# Altium schematic sheet Gate_Driver.SchDoc
size Letter; SheetNumber: 2; SheetTotal: 5
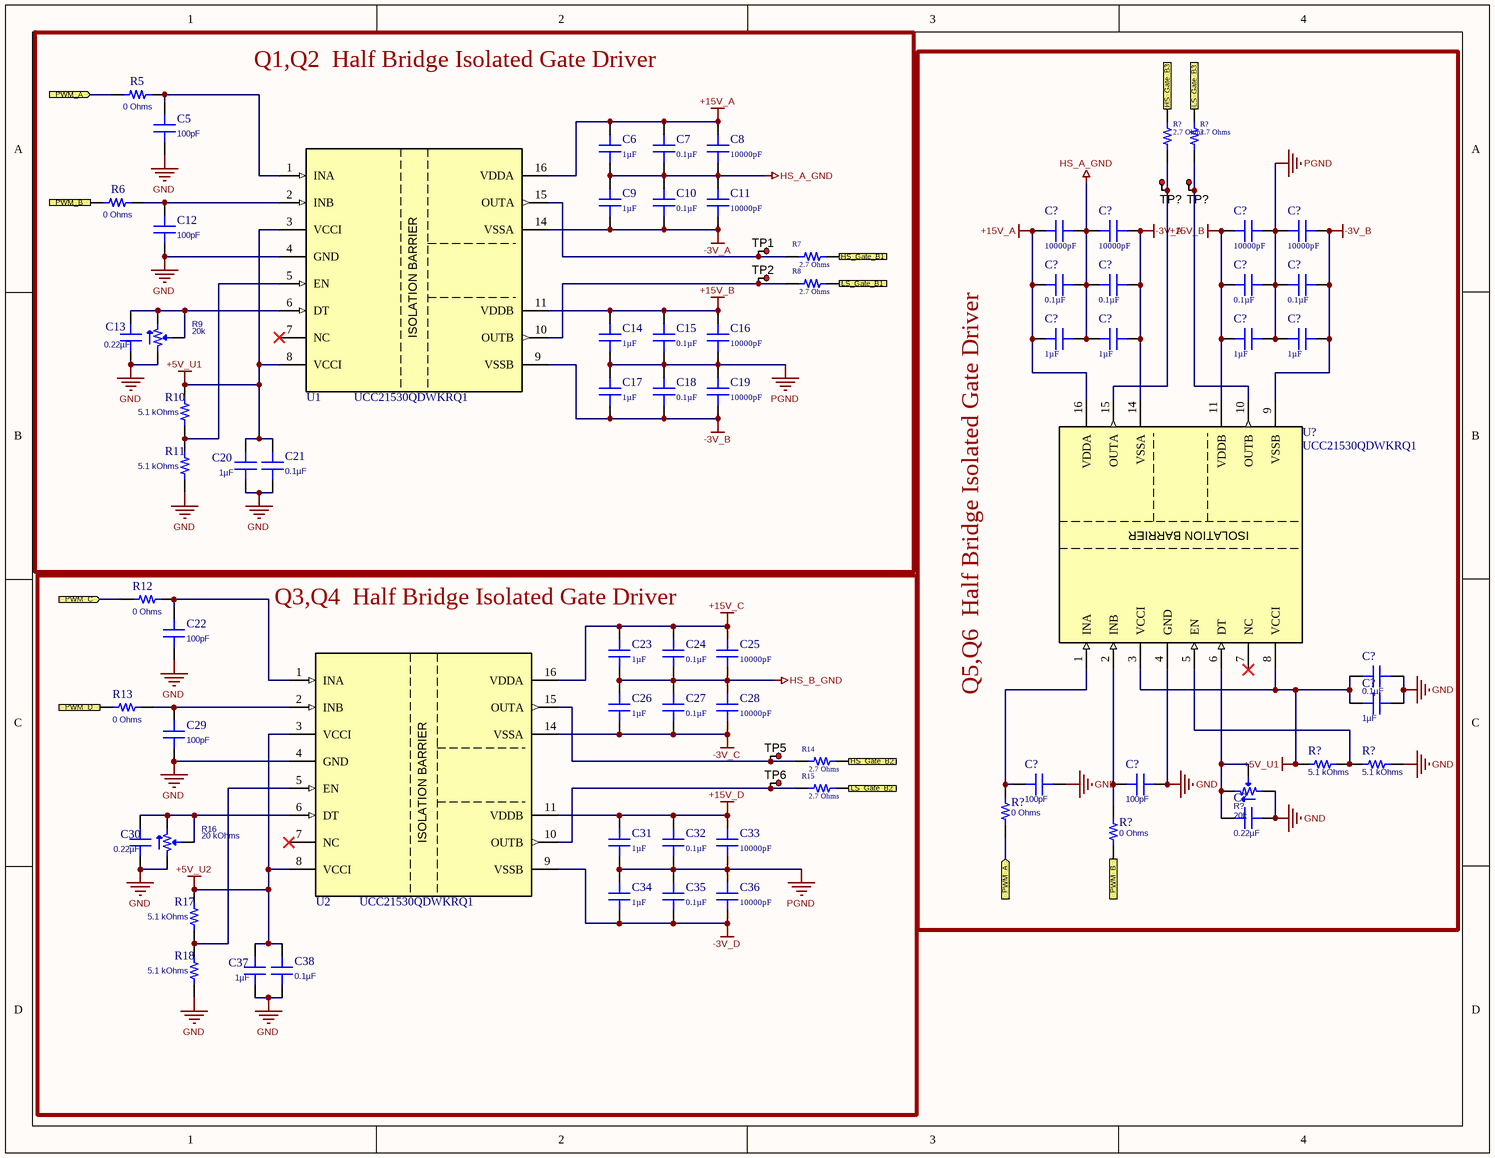
[diagram p0: Gate_Driver.SchDoc]

## Parts
(Parts that share a designator on the sheet are numbered #1, #2 ... from top to bottom, then left to right.)
C5  100pF  [CAP 0603_1608]
C6  1µF  [CAP 0603_1608]
C7  0.1µF  [CAP 0603_1608]
C8  10000pF  [CAP 0603_1608]
C9  1µF  [CAP 0603_1608]
C10  0.1µF  [CAP 0603_1608]
C11  10000pF  [CAP 0603_1608]
C12  100pF  [CAP 0603_1608]
C13  0.22µF  [CAP 0603_1608]
C14  1µF  [CAP 0603_1608]
C15  0.1µF  [CAP 0603_1608]
C16  10000pF  [CAP 0603_1608]
C17  1µF  [CAP 0603_1608]
C18  0.1µF  [CAP 0603_1608]
C19  10000pF  [CAP 0603_1608]
C20  1µF  [CAP 0603_1608]
C21  0.1µF  [CAP 0603_1608]
C22  100pF  [CAP 0603_1608]
C23  1µF  [CAP 0603_1608]
C24  0.1µF  [CAP 0603_1608]
C25  10000pF  [CAP 0603_1608]
C26  1µF  [CAP 0603_1608]
C27  0.1µF  [CAP 0603_1608]
C28  10000pF  [CAP 0603_1608]
C29  100pF  [CAP 0603_1608]
C30  0.22µF  [CAP 0603_1608]
C31  1µF  [CAP 0603_1608]
C32  0.1µF  [CAP 0603_1608]
C33  10000pF  [CAP 0603_1608]
C34  1µF  [CAP 0603_1608]
C35  0.1µF  [CAP 0603_1608]
C36  10000pF  [CAP 0603_1608]
C37  1µF  [CAP 0603_1608]
C38  0.1µF  [CAP 0603_1608]
C?#1  10000pF  [CAP 0603_1608]
C?#2  10000pF  [CAP 0603_1608]
C?#3  10000pF  [CAP 0603_1608]
C?#4  10000pF  [CAP 0603_1608]
C?#5  0.1µF  [CAP 0603_1608]
C?#6  0.1µF  [CAP 0603_1608]
C?#7  0.1µF  [CAP 0603_1608]
C?#8  0.1µF  [CAP 0603_1608]
C?#9  1µF  [CAP 0603_1608]
C?#10  1µF  [CAP 0603_1608]
C?#11  1µF  [CAP 0603_1608]
C?#12  1µF  [CAP 0603_1608]
C?#13  0.1µF  [CAP 0603_1608]
C?#14  1µF  [CAP 0603_1608]
C?#15  100pF  [CAP 0603_1608]
C?#16  100pF  [CAP 0603_1608]
C?#17  0.22µF  [CAP 0603_1608]
R5  0 Ohms  [RES 0603_1608]
R6  0 Ohms  [RES 0603_1608]
R7  2.7 Ohms  [RES 1206_3216]
R8  2.7 Ohms  [RES 1206_3216]
R9  20k  [POT BOURNS TRIMPOT TC33]
R10  5.1 kOhms  [RES 0603_1608]
R11  5.1 kOhms  [RES 0603_1608]
R12  0 Ohms  [RES 0603_1608]
R13  0 Ohms  [RES 0603_1608]
R14  2.7 Ohms  [RES 1206_3216]
R15  2.7 Ohms  [RES 1206_3216]
R16  20 kOhms  [POT BOURNS TRIMPOT TC33]
R17  5.1 kOhms  [RES 0603_1608]
R18  5.1 kOhms  [RES 0603_1608]
R?#1  2.7 Ohms  [RES 1206_3216]
R?#2  2.7 Ohms  [RES 1206_3216]
R?#3  5.1 kOhms  [RES 0603_1608]
R?#4  5.1 kOhms  [RES 0603_1608]
R?#5  20k  [POT BOURNS TRIMPOT TC33]
R?#6  0 Ohms  [RES 0603_1608]
R?#7  0 Ohms  [RES 0603_1608]
TP1  5010  [Keystone5010]  (value not drawn)
TP2  5010  [Keystone5010]  (value not drawn)
TP5  5010  [Keystone5010]  (value not drawn)
TP6  5010  [Keystone5010]  (value not drawn)
TP?#1  5010  [Keystone5010]  (value not drawn)
TP?#2  5010  [Keystone5010]  (value not drawn)
U1  UCC21530QDWKRQ1  [DW0016B_HV]
U2  UCC21530QDWKRQ1  [DW0016B_HV]
U?  UCC21530QDWKRQ1  [DW0016B_HV]

## Blocks framed on the sheet
Q1,Q2  Half Bridge Isolated Gate Driver: C5-C21 R5-R11 TP1 TP2 U1
Q5,Q6  Half Bridge Isolated Gate Driver: C?#1-C?#17 R?#1-R?#7 TP?#1 TP?#2 U?
Q3,Q4  Half Bridge Isolated Gate Driver: C22-C38 R12-R18 TP5 TP6 U2

## Ports
HS_Gate_B1 (out), HS_Gate_B2 (out), HS_Gate_B3 (out), LS_Gate_B1 (out), LS_Gate_B2 (out), LS_Gate_B3 (out), PWM_A (in), PWM_B (in), PWM_C (in), PWM_D (in)

## Nets
+5V_U1: C20.2 C21.2 C?#13.2 C?#14.2 R10.2 R?#3.2 U1.3(VCCI) U1.8(VCCI) U?.3(VCCI) U?.8(VCCI)
+5V_U2: C37.2 C38.2 R17.2 U2.3(VCCI) U2.8(VCCI)
+15V_A: C6.2 C7.2 C8.2 C?#1.2 C?#5.2 C?#9.2 U1.16(VDDA) U?.16(VDDA)
+15V_B: C14.2 C15.2 C16.2 C?#3.2 C?#7.2 C?#11.2 U1.11(VDDB) U?.11(VDDB)
+15V_C: C23.2 C24.2 C25.2 U2.16(VDDA)
+15V_D: C31.2 C32.2 C33.2 U2.11(VDDB)
-3V_A: C9.1 C10.1 C11.1 C?#2.1 C?#6.1 C?#10.1 U1.14(VSSA) U?.14(VSSA)
-3V_B: C17.1 C18.1 C19.1 C?#4.1 C?#8.1 C?#12.1 U1.9(VSSB) U?.9(VSSB)
-3V_C: C26.1 C27.1 C28.1 U2.14(VSSA)
-3V_D: C34.1 C35.1 C36.1 U2.9(VSSB)
GND: C5.1 C12.1 C13.1 C20.1 C21.1 C22.1 C29.1 C30.1 C37.1 C38.1 C?#13.1 C?#14.1 C?#15.1 C?#16.1 C?#17.1 R9.1 R11.1 R16.1 R18.1 R?#4.1 R?#5.1 U1.4(GND) U2.4(GND) U?.4(GND)
HS_A_GND: C6.1 C7.1 C8.1 C9.2 C10.2 C11.2 C?#1.1 C?#2.2 C?#5.1 C?#6.2 C?#9.1 C?#10.2
HS_B_GND: C23.1 C24.1 C25.1 C26.2 C27.2 C28.2
PGND: C14.1 C15.1 C16.1 C17.2 C18.2 C19.2 C31.1 C32.1 C33.1 C34.2 C35.2 C36.2 C?#3.1 C?#4.2 C?#7.1 C?#8.2 C?#11.1 C?#12.2
HS_Gate_B1: R7.2 ; port HS_Gate_B1
HS_Gate_B2: R14.2 ; port HS_Gate_B2
HS_Gate_B3: R?#1.2 ; port HS_Gate_B3
LS_Gate_B1: R8.2 ; port LS_Gate_B1
LS_Gate_B2: R15.2 ; port LS_Gate_B2
LS_Gate_B3: R?#2.2 ; port LS_Gate_B3
PWM_A: R5.1 R?#6.1 ; port PWM_A
PWM_B: R6.1 R?#7.1 ; port PWM_B
PWM_C: R12.1 ; port PWM_C
PWM_D: R13.1 ; port PWM_D
NetC5_2: C5.2 R5.2 U1.1(INA)
NetC12_2: C12.2 R6.2 U1.2(INB)
NetC13_2: C13.2 R9.2 R9.3 U1.6(DT)
NetC22_2: C22.2 R12.2 U2.1(INA)
NetC29_2: C29.2 R13.2 U2.2(INB)
NetC30_2: C30.2 R16.2 R16.3 U2.6(DT)
NetC?#15_2: C?#15.2 R?#6.2 U?.1(INA)
NetC?#16_2: C?#16.2 R?#7.2 U?.2(INB)
NetC?#17_2: C?#17.2 R?#5.2 R?#5.3 U?.6(DT)
NetR7_1: R7.1 TP1.1 U1.15(OUTA)
NetR8_1: R8.1 TP2.1 U1.10(OUTB)
NetR10_1: R10.1 R11.2 U1.5(EN)
NetR14_1: R14.1 TP5.1 U2.15(OUTA)
NetR15_1: R15.1 TP6.1 U2.10(OUTB)
NetR17_1: R17.1 R18.2 U2.5(EN)
NetR?#1_1: R?#1.1 TP?#1.1 U?.15(OUTA)
NetR?#2_1: R?#2.1 TP?#2.1 U?.10(OUTB)
NetR?#3_1: R?#3.1 R?#4.2 U?.5(EN)

Not connected (* = marked no-connect by the designer): U1 7(NC)*; U2 7(NC)*; U? 7(NC)*

## Notes on the sheet
- (in symbol UCC21530QDWKRQ1 (2)) ISOLATION BARRIER

## Library data of the parts
C5 C12 C22 C29 C?#15 C?#16 = GCM1885C2A101JA16D: CAP CER 100PF 100V C0G/NP0 0603; Manufacturer: Murata Electronics; Temperature Coefficient: C0G, NP0; Tolerance: ±5%; Part Number: GCM1885C2A101JA16D; Value: 100pF; Applications: Automotive; Capacitance: 100pF; ComponentLink1Description: Datasheet; ComponentLink1URL: https://psearch.en.murata.com/capacitor/product/GCM1885C2A101JA16%23.pdf; ComponentLink2Description: DigiKey Link; ComponentLink2URL: http://digikey.com/product-detail/en/murata-electronics/GCM1885C2A101JA16D/490-4771-1-ND/1641690; Device Package: 0603 (1608 Metric); LastUpdated: 2/9/2020 01:03:33; Lifecycle Status: Active; Minimum Order: 1; Mounting Type: Surface Mount, MLCC; Operating Temperature: -55°C ~ 125°C; Package / Case: 0603 (1608 Metric); Packaging: TapeAndReel; PartId: 3835; Part Status: Active; Price: 0.02; Ratings: AEC-Q200; Series: GCM; Size / Dimension: 0.063" L x 0.031" W (1.60mm x 0.80mm); Supplier 1: DigiKey; Supplier Part Number 1: 490-4771-1-ND; Thickness (Max): 0.035" (0.90mm); Voltage - Rated: 100V
C6 C9 C14 C17 C20 C23 C26 C31 C34 C37 C?#9-C?#12 C?#14 = UMK107AB7105KA-T: CAP CER 1UF 50V X7R 0603; Manufacturer: Taiyo Yuden; Tolerance: ±10%; Part Number: UMK107AB7105KA-T; Value: 1µF; Applications: General Purpose; Capacitance: 1µF; ComponentLink1Description: Datasheet; ComponentLink1URL: https://www.yuden.co.jp/productdata/catalog/mlcc01_e.pdf; ComponentLink2Description: DigiKey Link; ComponentLink2URL: http://digikey.com/product-detail/en/taiyo-yuden/UMK107AB7105KA-T/587-3247-1-ND/3660107; Device Package: 0603 (1608 Metric); LastUpdated: 2/9/2020 01:03:17; Lifecycle Status: Active; Minimum Order: 1; Mounting Type: Surface Mount, MLCC; Operating Temperature: -55°C ~ 125°C; Package / Case: 0603 (1608 Metric); Packaging: TapeAndReel; PartId: 12796; Part Status: Active; Price: 0.05; Series: M; Size / Dimension: 0.063" L x 0.031" W (1.60mm x 0.80mm); Supplier 1: DigiKey; Supplier Part Number 1: 587-3247-1-ND; Temperature Coefficient: X7R; Thickness (Max): 0.037" (0.95mm); Voltage - Rated: 50V
C7 C10 C15 C18 C24 C27 C32 C35 C?#5-C?#8 = C0603C104M5RACTU: CAP CER 0.1UF 50V X7R 0603; Manufacturer: KEMET; Tolerance: ±20%; Part Number: C0603C104M5RACTU; Value: 0.1µF; Applications: Bypass, Decoupling; Capacitance: 0.1µF; ComponentLink1Description: Datasheet; ComponentLink1URL: https://api.kemet.com/component-edge/download/datasheet/C0603C104M5RACTU.pdf; ComponentLink2Description: DigiKey Link; ComponentLink2URL: http://digikey.com/product-detail/en/kemet/C0603C104M5RACTU/399-7845-1-ND/3471568; Device Package: 0603 (1608 Metric); LastUpdated: 2/9/2020 01:03:01; Lifecycle Status: Active; Minimum Order: 1; Mounting Type: Surface Mount, MLCC; Operating Temperature: -55°C ~ 125°C; Package / Case: 0603 (1608 Metric); Packaging: TapeAndReel; PartId: 17854; Part Status: Active; Price: 0.01; Series: SMD Comm X7R; Size / Dimension: 0.063" L x 0.031" W (1.60mm x 0.80mm); Supplier 1: DigiKey; Supplier Part Number 1: 399-7845-1-ND; Temperature Coefficient: X7R; Thickness (Max): 0.034" (0.87mm); Voltage - Rated: 50V
C8 C11 C16 C19 C25 C28 C33 C36 C?#1-C?#4 = CGA3E2C0G1H103J080AA: CAP CER 10000PF 50V C0G 0603; Manufacturer: TDK Corporation; Temperature Coefficient: C0G, NP0; Tolerance: ±5%; Part Number: CGA3E2C0G1H103J080AA; Value: 10000pF; Applications: Automotive; Capacitance: 10000pF; ComponentLink1Description: Datasheet; ComponentLink1URL: https://product.tdk.com/info/en/catalog/datasheets/mlcc_automotive_general_en.pdf?ref_disty=digikey; ComponentLink2Description: DigiKey Link; ComponentLink2URL: http://digikey.com/product-detail/en/tdk-corporation/CGA3E2C0G1H103J080AA/445-6916-1-ND/2672934; Device Package: 0603 (1608 Metric); LastUpdated: 2/9/2020 01:03:33; Lifecycle Status: Active; Minimum Order: 1; Mounting Type: Surface Mount, MLCC; Operating Temperature: -55°C ~ 125°C; Package / Case: 0603 (1608 Metric); Packaging: TapeAndReel; PartId: 4079; Part Status: Active; Price: 0.06; Ratings: AEC-Q200; Series: CGA; Size / Dimension: 0.063" L x 0.031" W (1.60mm x 0.80mm); Supplier 1: DigiKey; Supplier Part Number 1: 445-6916-1-ND; Thickness (Max): 0.035" (0.90mm); Voltage - Rated: 50V
C13 C30 C?#17 = GRM188R71E224KA88J: CAP CER 0.22UF 25V X7R 0603; Manufacturer: Murata Electronics; Tolerance: ±10%; Part Number: GRM188R71E224KA88J; Value: 0.22µF; Applications: General Purpose; Capacitance: 0.22µF; ComponentLink1Description: Datasheet; ComponentLink1URL: https://www.murata.com/~/media/webrenewal/support/library/catalog/products/capacitor/mlcc/c02e.ashx?la=en-us; ComponentLink2Description: DigiKey Link; ComponentLink2URL: http://digikey.com/product-detail/en/murata-electronics/GRM188R71E224KA88J/490-11522-1-ND/5333362; Device Package: 0603 (1608 Metric); LastUpdated: 2/9/2020 01:03:21; Lifecycle Status: Active; Minimum Order: 1; Mounting Type: Surface Mount, MLCC; Operating Temperature: -55°C ~ 125°C; Package / Case: 0603 (1608 Metric); Packaging: TapeAndReel; PartId: 10549; Part Status: Active; Price: 0.03; Series: GRM; Size / Dimension: 0.063" L x 0.031" W (1.60mm x 0.80mm); Supplier 1: DigiKey; Supplier Part Number 1: 490-11522-1-ND; Temperature Coefficient: X7R; Thickness (Max): 0.035" (0.90mm); Voltage - Rated: 25V
C21 C38 C?#13 = CGA3E2X7R1E104K080AA: CAP CER 0.1UF 25V X7R 0603; Manufacturer: TDK Corporation; Tolerance: ±10%; Part Number: CGA3E2X7R1E104K080AA; Value: 0.1µF; Applications: Automotive; Capacitance: 0.1µF; ComponentLink1Description: Datasheet; ComponentLink1URL: https://product.tdk.com/info/en/catalog/datasheets/mlcc_automotive_general_en.pdf?ref_disty=digikey; ComponentLink2Description: DigiKey Link; ComponentLink2URL: http://digikey.com/product-detail/en/tdk-corporation/CGA3E2X7R1E104K080AA/445-5667-1-ND/2443707; Device Package: 0603 (1608 Metric); LastUpdated: 2/9/2020 01:03:30; Lifecycle Status: Active; Minimum Order: 1; Mounting Type: Surface Mount, MLCC; Operating Temperature: -55°C ~ 125°C; Package / Case: 0603 (1608 Metric); Packaging: TapeAndReel; PartId: 5534; Part Status: Active; Price: 0.01; Ratings: AEC-Q200; Series: CGA; Size / Dimension: 0.063" L x 0.031" W (1.60mm x 0.80mm); Supplier 1: DigiKey; Supplier Part Number 1: 445-5667-1-ND; Temperature Coefficient: X7R; Thickness (Max): 0.035" (0.90mm); Voltage - Rated: 25V
R5 R6 R12 R13 R?#6 R?#7 = CRCW06030000Z0EAHP: RES SMD 0 OHM JUMPER 1/4W 0603; Manufacturer: Vishay Dale; Power (Watts): 0.25W, 1/4W; Part Number: CRCW06030000Z0EAHP; Value: 0 Ohms; ComponentLink1Description: Datasheet; ComponentLink1URL: http://www.vishay.com/docs/20043/crcwhpe3.pdf; ComponentLink2Description: DigiKey Link; ComponentLink2URL: http://digikey.com/product-detail/en/vishay-dale/CRCW06030000Z0EAHP/541-0.0SBCT-ND/2222749; Composition: Thick Film; Device Package: 0603 (1608 Metric); Features: Automotive AEC-Q200, Pulse Withstanding; Height - Seated (Max): 0.022" (0.55mm); LastUpdated: 2/9/2020 01:10:23; Lifecycle Status: Active; Minimum Order: 1; Number of Terminations: 2; Operating Temperature: -55°C ~ 155°C; Package / Case: 0603 (1608 Metric); Packaging: TapeAndReel; PartId: 5474; Part Status: Active; Price: 0.02; Ratings: AEC-Q200; Resistance: 0 Ohms; Series: CRCW-HP; Size / Dimension: 0.063" L x 0.033" W (1.60mm x 0.85mm); Supplier 1: DigiKey; Supplier Part Number 1: 541-0.0SBCT-ND; Supplier Device Package: 0603; Tolerance: Jumper
R7 R8 R14 R15 R?#1 R?#2 = CRCW12062R70FKEAHP: RES SMD 2.7 OHM 1% 3/4W 1206; Manufacturer: Vishay Dale; Power (Watts): 0.75W, 3/4W; Temperature Coefficient: ±100ppm/°C; Part Number: CRCW12062R70FKEAHP; ComponentLink1Description: Datasheet; ComponentLink1URL: http://www.vishay.com/docs/20043/crcwhpe3.pdf; ComponentLink2Description: DigiKey Link; ComponentLink2URL: http://digikey.com/product-detail/en/vishay-dale/CRCW12062R70FKEAHP/541-2.70UCT-ND/5326978; Composition: Thick Film; Device Package: 1206 (3216 Metric); Features: Automotive AEC-Q200, Pulse Withstanding; Height - Seated (Max): 0.024" (0.60mm); LastUpdated: 2/9/2020 01:12:48; Lifecycle Status: Active; Minimum Order: 1; Number of Terminations: 2; Operating Temperature: -55°C ~ 155°C; Package / Case: 1206 (3216 Metric); Packaging: TapeAndReel; PartId: 36112; Part Status: Active; Price: 0.06; Ratings: AEC-Q200; Resistance: 2.7 Ohms; Series: CRCW-HP; Size / Dimension: 0.122" L x 0.063" W (3.10mm x 1.60mm); Supplier 1: DigiKey; Supplier Part Number 1: 541-2.70UCT-ND; Supplier Device Package: 1206; Tolerance: ±1%; Value: 2.7 Ohms
R9 R?#5 = TC33X-2-203E: TRIMMER 20K OHM 0.1W J LEAD TOP; Manufacturer: Bourns Inc.; Adjustment Type: Top Adjustment; Number of Turns: 1; Power (Watts): 0.1W, 1/10W; Resistance: 20 kOhms; Resistive Material: Cermet; Temperature Coefficient: ±250ppm/°C; Tolerance: ±25%; Part Number: TC33X-2-203E; ComponentLink1Description: Datasheet; ComponentLink1URL: https://www.bourns.com/docs/Product-Datasheets/TC33.pdf; ComponentLink2Description: DigiKey Link; ComponentLink2URL: http://digikey.com/product-detail/en/bourns-inc/TC33X-2-203E/TC33X-2-203ECT-ND/3437930; LastUpdated: 2/9/2020 01:21:42; Lifecycle Status: Active; Minimum Order: 1; Mounting Type: Surface Mount; Packaging: TapeAndReel; PartId: 12; Part Status: Active; Price: 0.15; Series: Trimpot® TC33 - Open Frame; Size / Dimension: Rectangular - 0.150" x 0.142" Face x 0.047" H (3.80mm x 3.60mm x 1.20mm); Supplier 1: DigiKey; Supplier Part Number 1: TC33X-2-203ECT-ND; Termination Style: J Lead; Value: 20k
R10 R11 R17 R18 R?#3 R?#4 = RC0603JR-075K1L: RES SMD 5.1K OHM 5% 1/10W 0603; Manufacturer: Yageo; Power (Watts): 0.1W, 1/10W; Temperature Coefficient: ±100ppm/°C; Part Number: RC0603JR-075K1L; Value: 5.1 kOhms; ComponentLink1Description: Datasheet; ComponentLink1URL: https://www.yageo.com/upload/media/product/productsearch/datasheet/rchip/PYu-RC_Group_51_RoHS_L_10.pdf; ComponentLink2Description: DigiKey Link; ComponentLink2URL: http://digikey.com/product-detail/en/yageo/RC0603JR-075K1L/311-5.1KGRCT-ND/729743; Composition: Thick Film; Device Package: 0603 (1608 Metric); Features: Moisture Resistant; Height - Seated (Max): 0.022" (0.55mm); LastUpdated: 2/9/2020 01:09:58; Lifecycle Status: Active; Minimum Order: 1; Number of Terminations: 2; Operating Temperature: -55°C ~ 155°C; Package / Case: 0603 (1608 Metric); Packaging: CutTape; PartId: 17113; Part Status: Active; Price: 0.10; Resistance: 5.1 kOhms; Series: RC; Size / Dimension: 0.063" L x 0.031" W (1.60mm x 0.80mm); Supplier 1: DigiKey; Supplier Part Number 1: 311-5.1KGRCT-ND; Supplier Device Package: 0603; Tolerance: ±5%
R16 = TC33X-2-203E: TRIMMER 20K OHM 0.1W J LEAD TOP; Manufacturer: Bourns Inc.; Adjustment Type: Top Adjustment; Number of Turns: 1; Power (Watts): 0.1W, 1/10W; Resistive Material: Cermet; Temperature Coefficient: ±250ppm/°C; Tolerance: ±25%; Part Number: TC33X-2-203E; ComponentLink1Description: Datasheet; ComponentLink1URL: https://www.bourns.com/docs/Product-Datasheets/TC33.pdf; ComponentLink2Description: DigiKey Link; ComponentLink2URL: http://digikey.com/product-detail/en/bourns-inc/TC33X-2-203E/TC33X-2-203ECT-ND/3437930; LastUpdated: 2/9/2020 01:21:42; Lifecycle Status: Active; Minimum Order: 1; Mounting Type: Surface Mount; Packaging: TapeAndReel; PartId: 12; Part Status: Active; Price: 0.15; Resistance: 20 kOhms; Series: Trimpot® TC33 - Open Frame; Size / Dimension: Rectangular - 0.150" x 0.142" Face x 0.047" H (3.80mm x 3.60mm x 1.20mm); Supplier 1: DigiKey; Supplier Part Number 1: TC33X-2-203ECT-ND; Termination Style: J Lead; Value: 20 kOhms
TP1 TP2 TP5 TP6 TP?#1 TP?#2 = 5010: Test Point, Multipurpose, Red, TH; Manufacturer: Keystone; CompType: Test Point Loop; ContactFinish: Silver; SymbolVersion: 2008-04-04; PartNumber: 5010; PackageReference: Red Multipurpose Testpoint; RoHS: Y; MountType: TH; ComponentLink1Description: Datasheet URL; ComponentLink1URL: http://www.keyelco.com/userAssets/file/M60-2p60.pdf; Color: Red; Publisher: Texas Instruments; LatestRevisionDate: 2016-02-11; Supplier 1: Digi-Key; Supplier Part Number 1: 36-5010-ND; Supplier 2: Mouser; Supplier Part Number 2: 534-5010
U1 U2 U? = UCC21530QDWKRQ1 (2): Isolated Dual-Channel Gate Driver 6A 2-Output High Side/Low Side/Half-Bridge 14-Pin SOIC T/R; Manufacturer: Texas Instruments; Supplier 1: Mouser; Supplier Part Number 1: 595-UCC21530QDWKRQ1; Manufacturer Part Number: UCC21530QDWKRQ1; RoHS: Yes; Category: Integrated Circuits (ICs); Stock 1: 1426; Pricing 1: 1=5,17000, 10=4,64000, 50=4,39000, 100=3,61000, 1000=2,59000, 10000=2,50000 (USD); RoHS Compliant: Yes